# EAGLE design Schematic1 (EAGLE 9.2.2)
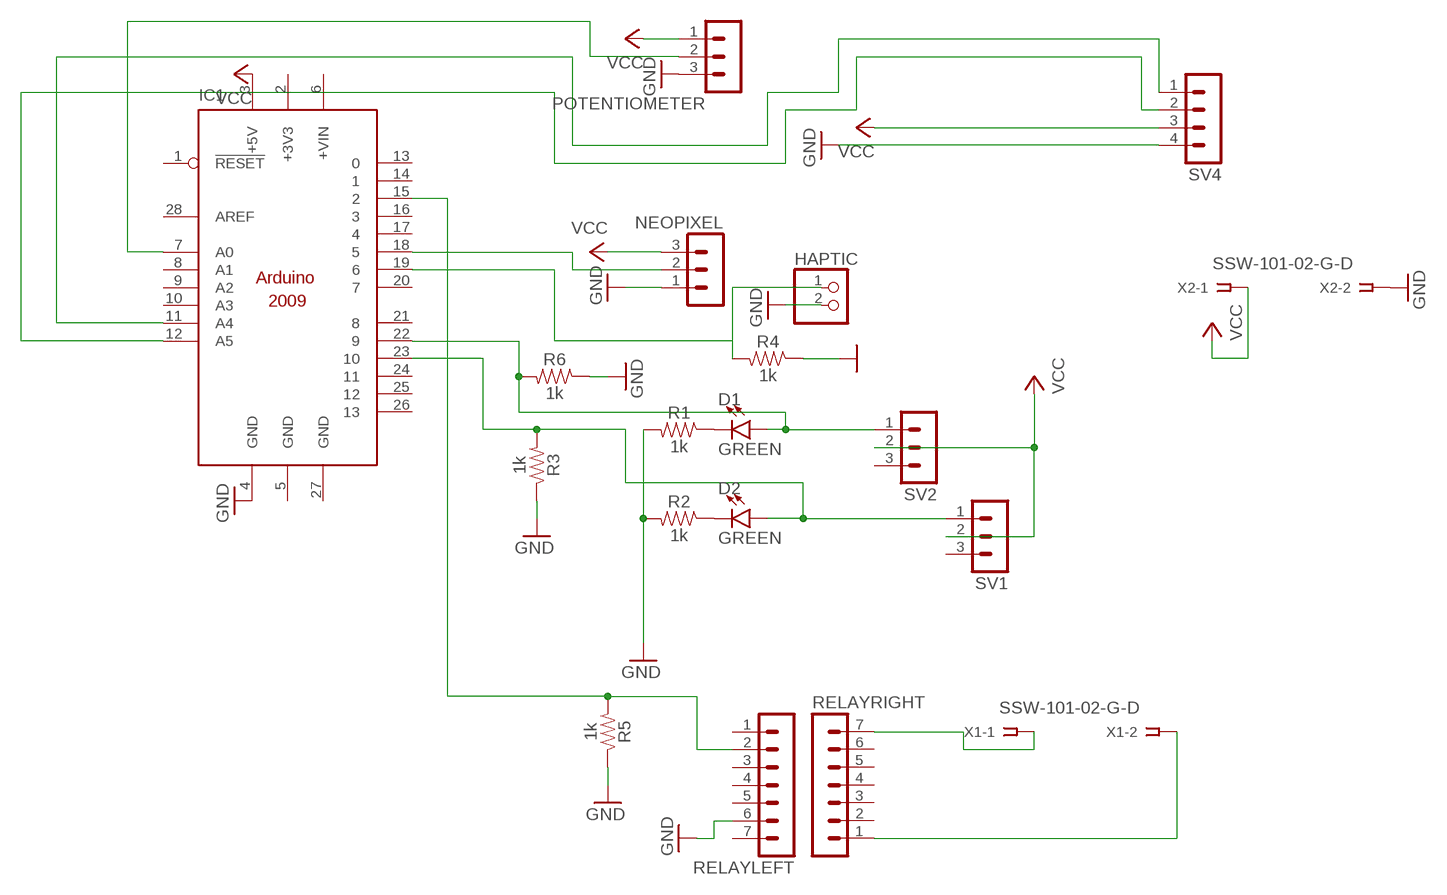
[diagram p0: schematic, sheet 1]

## Parts
D1  GREEN  LED-GREEN1206  [LED-1206]
D2  GREEN  LED-GREEN1206  [LED-1206]
HAPTIC  PINHD-1X2  [1X02]
IC1  ARDUINO2009_10  [ARDUINO2009]
NEOPIXEL  MA03-1  [MA03-1]
POTENTIOMETER  MA03-1  [MA03-1]
R1  1k  1KOHM-0603-1/10W-1%  [0603]
R2  1k  1KOHM-0603-1/10W-1%  [0603]
R3  1k  1KOHM-0603-1/10W-1%  [0603]
R4  1k  1KOHM-0603-1/10W-1%  [0603]
R5  1k  1KOHM-0603-1/10W-1%  [0603]
R6  1k  1KOHM-0603-1/10W-1%  [0603]
RELAYLEFT  MA07-1  [MA07-1]
RELAYRIGHT  MA07-1  [MA07-1]
SV1  MA03-1  [MA03-1]
SV2  MA03-1  [MA03-1]
SV4  MA04-1  [MA04-1]
X1  SSW-101-02-G-D  [SSW-101-02-G-D]
X2  SSW-101-02-G-D  [SSW-101-02-G-D]

## Nets
GND: HAPTIC.2 IC1.4(GND) NEOPIXEL.1 POTENTIOMETER.3 R1.2 R2.2 R3.1 R4.1 R5.1 R6.1 RELAYLEFT.6 SV4.4 X2.2
N$1: D1.C R1.1
N$2: D2.C R2.1
N$4: D2.A IC1.23 R3.2 SV1.1
N$5: D1.A IC1.22 R6.2 SV2.1
N$6: IC1.18 NEOPIXEL.2
N$7: IC1.11(A4) SV4.1
N$8: IC1.12(A5) SV4.2
N$9: HAPTIC.1 IC1.19 R4.2
N$11: RELAYRIGHT.7 X1.1
N$12: IC1.7(A0) POTENTIOMETER.2
N$13: RELAYRIGHT.1 X1.2
N$14: IC1.15 R5.2 RELAYLEFT.2
VCC: IC1.3(+5V) NEOPIXEL.3 POTENTIOMETER.1 SV1.2 SV2.2 SV4.3 X2.1
Unconnected: IC1.1(!RESET) IC1.6(+VIN) IC1.8(A1) IC1.9(A2) IC1.10(A3) IC1.13 IC1.14 IC1.16 IC1.17 IC1.20 IC1.21 IC1.24 IC1.25 IC1.26 IC1.28(AREF) RELAYLEFT.1 RELAYLEFT.3 RELAYLEFT.4 RELAYLEFT.5 RELAYLEFT.7 RELAYRIGHT.2 RELAYRIGHT.3 RELAYRIGHT.4 RELAYRIGHT.5 RELAYRIGHT.6 SV1.3 SV2.3

## Power pins joined to a net without a drawn wire
+3V3: IC1.2(+3V3)
GND: IC1.5(GND) IC1.27(GND)

## Library data of the parts
D1 D2 = SparkFun-LED:LED-GREEN: Green SMD LED Used in manufacturing of various products at SparkFun Packages: 0603 - SMD 0603 package [Product Link] <http://www.futureelectronics.com/en/technologies/semiconductors/optoelectronics/leds/Pages/9894312-LTST-C190GKT.aspx?CrossPart=HSMG-C190&IM=0> LilyPad 1206 - SMD1206 LilyPad package [Product Link] <http://www.futureelectronics.com/en/Technologies/Product.aspx?ProductID=IN150NGHARVATEKCORPORATION2049943&IM=0> 1206 - SMD1206 package [Product Link] <http://www.futureelectronics.com/en/technologies/semiconductors/optoelectronics/leds/Pages/8315665-LTST-C150KGKT.aspx?IM=0> 1206 Bottom Mount -SMD 1206 Bottom Mount [Product Link] <http://www.digikey.com/product-detail/en/lite-on-inc/LTST-C230KGKT/160-1456-1-ND/386854> SparkFun Products: Pro Mini 328 -5V <https://www.sparkfun.com/products/821> RedBoard <https://www.sparkfun.com/products/12757> MP3 Trigger <https://www.sparkfun.com/products/13720> Makey Makey <https://www.sparkfun.com/products/11076>; PROD_ID: DIO-00862
HAPTIC = pinhead:PINHD-1X2: PIN HEADER; SPICEPREFIX: B
IC1 = arduino:ARDUINO2009_1: The Arduino Duemilanove ("2009") is a microcontroller board based on the ATmega168 or ATmega328. - 14 digital input/output pins (of which 6 can be used as PWM outputs) - 6 analog inputs, a 16 MHz crystal oscillator - USB connection - power jack - ISP header - reset button It contains everything needed to support the microcontroller; simply connect it to a computer with a USB cable or power it with a AC-to-DC adapter or battery to get started http://arduino.cc/en/Main/ArduinoBoardDuemilanove
NEOPIXEL POTENTIOMETER SV1 SV2 = con-lstb:MA03-1: PIN HEADER; OC_FARNELL: unknown; OC_NEWARK: unknown
R1-R6 = SparkFun-Resistors:1KOHM: 1kΩ resistor A resistor is a passive two-terminal electrical component that implements electrical resistance as a circuit element. Resistors act to reduce current flow, and, at the same time, act to lower voltage levels within circuits. - Wikipedia; PROD_ID: RES-07856
RELAYLEFT RELAYRIGHT = con-lstb:MA07-1: PIN HEADER; OC_FARNELL: unknown; OC_NEWARK: unknown
SV4 = con-lstb:MA04-1: PIN HEADER; OC_FARNELL: unknown; OC_NEWARK: unknown
X1 X2 = con-samtec:SSW-101-02-G: THROUGH-HOLE .025" SQ POST SOCKET Source: Samtec SSW.pdf; MF: Samtec Inc.; MPN: SSW-101-02-G-D; OC_FARNELL: unknown; OC_NEWARK: 82P1456

## Board
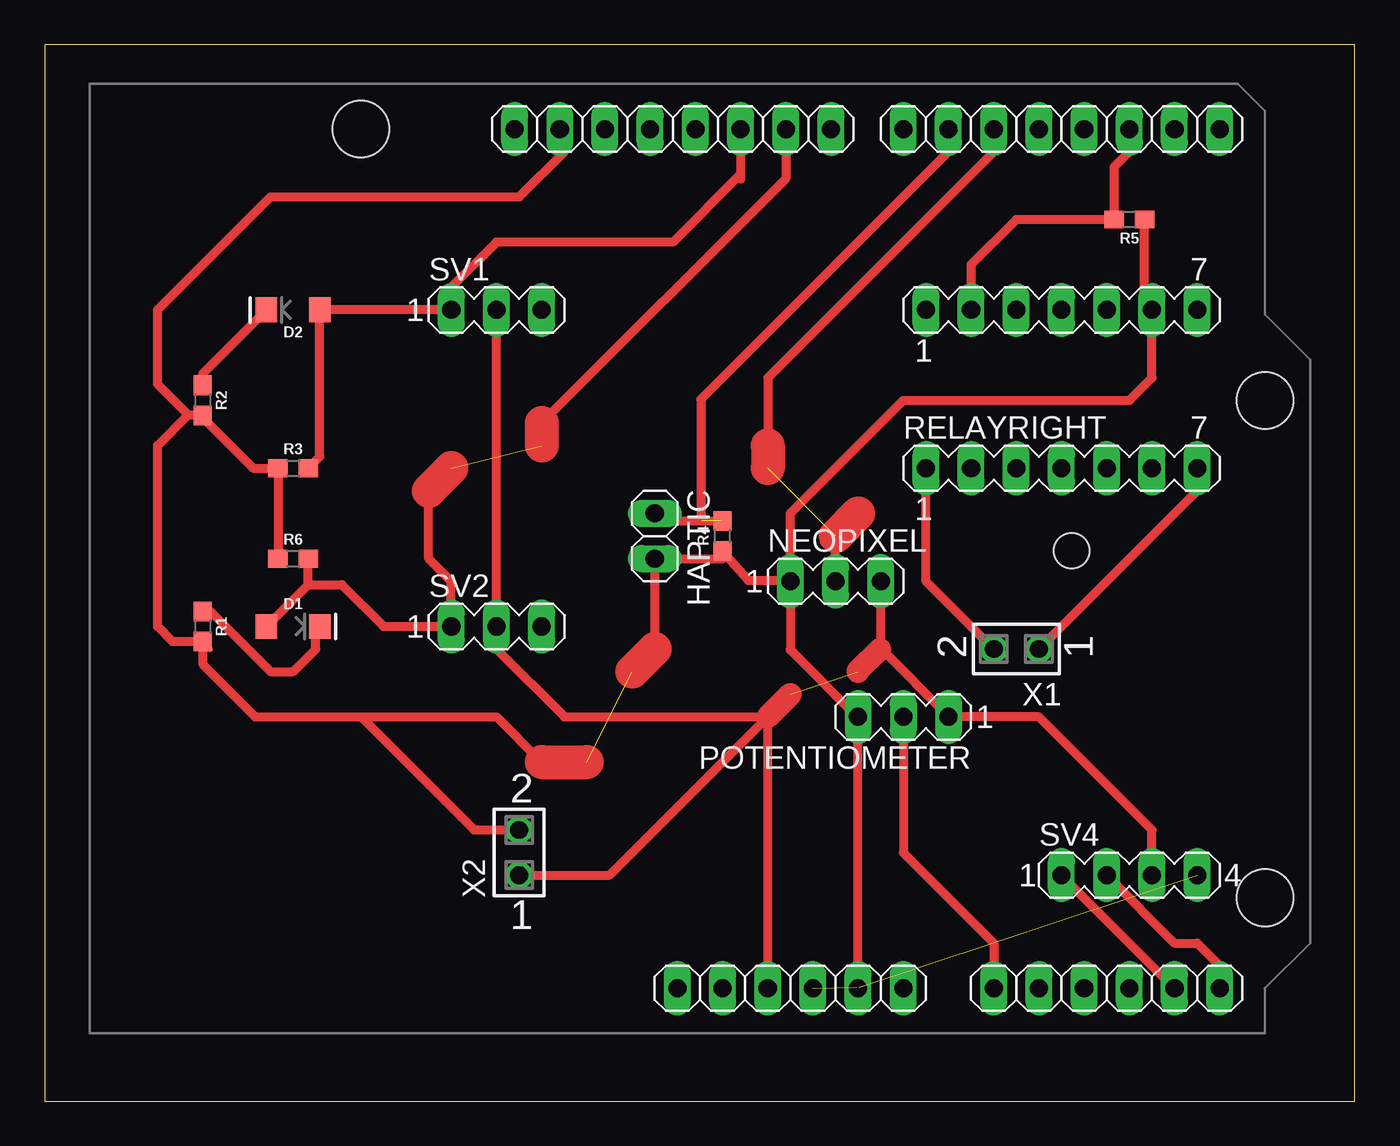
[diagram p1: board, top side]
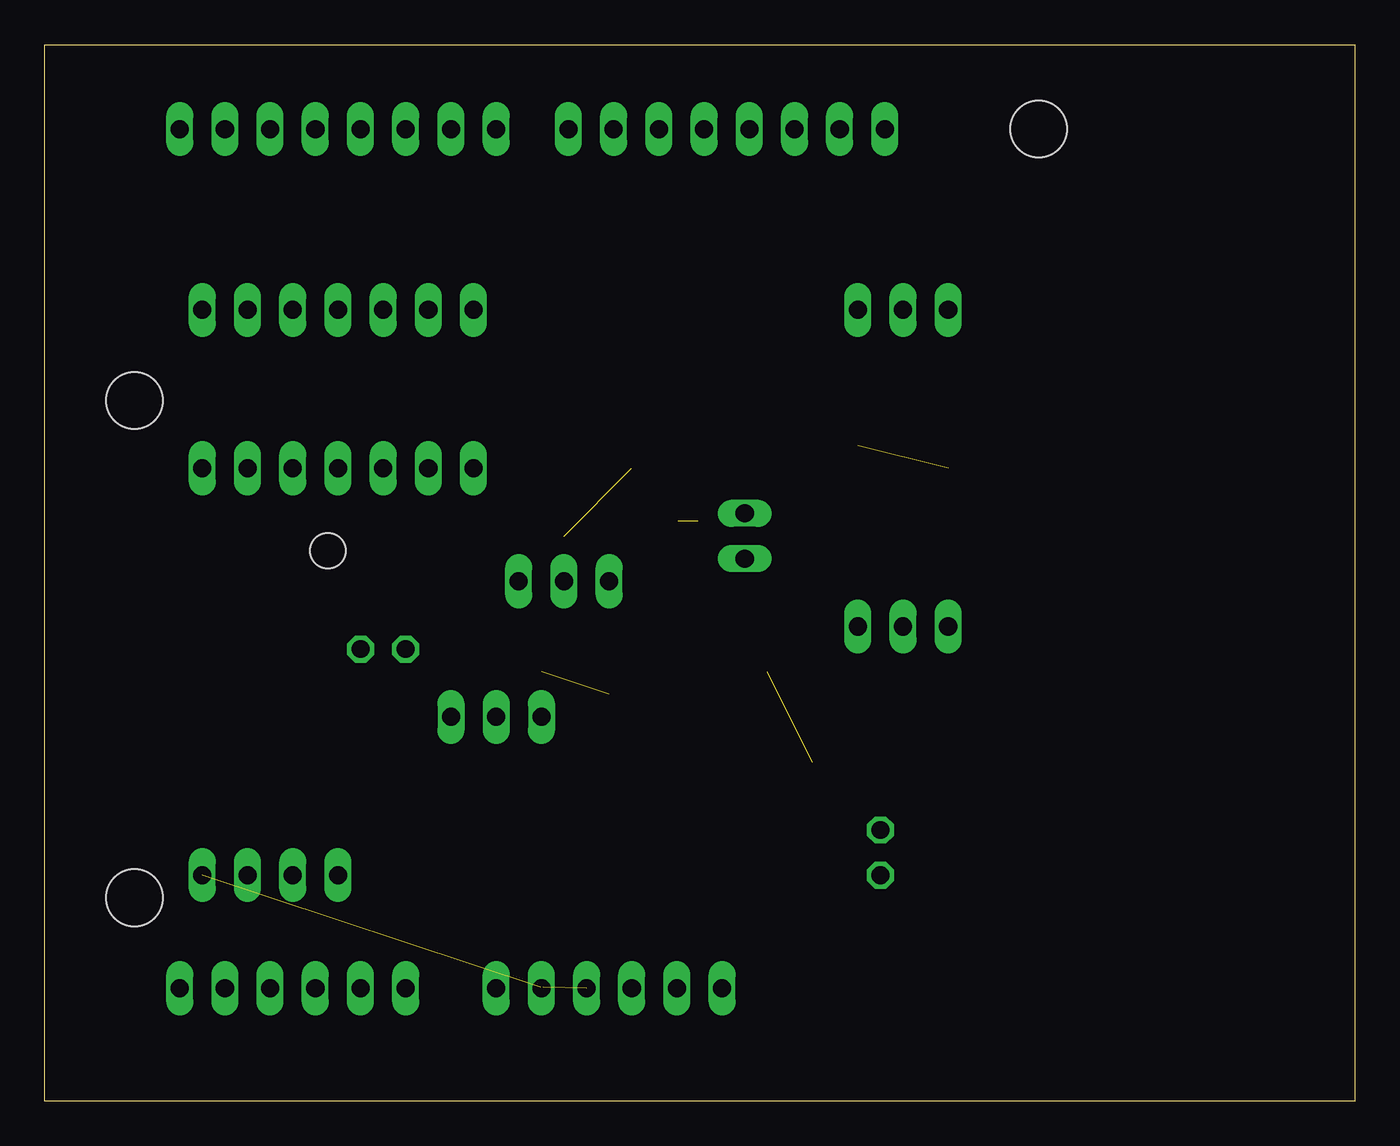
[diagram p2: board, bottom side, seen from below]

Size 73.64 x 59.36 mm. Coordinates in mm from the lower left corner, seen from the top.
Outline: 0,0 73.64,0 73.64,59.36 0,59.36 0,0
Copper layers (1*16): Top 0.035mm / dielectric 1.5mm / Bottom 0.035mm
Design rules "default": minimum track width 6mil, minimum drill 0.35mm, track to track 6mil, track to pad 6mil, pad to pad 6mil, via to via 6mil, smd to smd 6mil, copper to edge 40mil, drill to drill 6mil, minimum pad ring 10mil, minimum via ring 8mil, stop-mask expansion 4mil, vias tented up to drill 0mil, thermal gap 10mil

### Footprints (pad centres in the part's own frame; a part is rotated, then mirrored left to right if it is on the bottom)
LED-1206 = smd 1.2 x 1.4: A -1.5,0; C 1.5,0
1X02 = drill 1.016 long: 1 -1.27,0; 2 1.27,0
ARDUINO2009 = drill 1.016 long: 1 33.02,2.54; 2 35.56,2.54; 3 38.1,2.54; 4 40.64,2.54; 5 43.18,2.54; 6 45.72,2.54; 7 50.8,2.54; 8 53.34,2.54; 9 55.88,2.54; 10 58.42,2.54; 11 60.96,2.54; 12 63.5,2.54; 13 63.5,50.8; 14 60.96,50.8; 15 58.42,50.8; 16 55.88,50.8; 17 53.34,50.8; 18 50.8,50.8; 19 48.26,50.8; 20 45.72,50.8; 21 41.656,50.8; 22 39.116,50.8; 23 36.576,50.8; 24 34.036,50.8; 25 31.496,50.8; 26 28.956,50.8; 27 26.416,50.8; 28 23.876,50.8 | hole 3.2: 15.24,50.8; 66.04,35.56; 66.04,7.62 | hole 2: 55.17,27.114
MA03-1 = drill 1.016 long: 1 -2.54,0; 2 0,0; 3 2.54,0
0603 = smd 1.1 x 1: 1 -0.85,0; 2 0.85,0
MA07-1 = drill 1.016 long: 1 -7.62,0; 2 -5.08,0; 3 -2.54,0; 4 0,0; 5 2.54,0; 6 5.08,0; 7 7.62,0
MA04-1 = drill 1.016 long: 1 -3.81,0; 2 -1.27,0; 3 1.27,0; 4 3.81,0
SSW-101-02-G-D = drill 1 pad 1.5 octagon: 1 0,-1.27; 2 0,1.27

### Placement (x,y rotation side)
D1  13.97,26.67 0 top
D2  13.97,44.45 180 top
HAPTIC  34.29,31.75 270 top
IC1  2.54,3.81 0 top
NEOPIXEL  44.45,29.21 0 top
POTENTIOMETER  48.26,21.59 180 top
R1  8.89,26.67 270 top
R2  8.89,39.37 270 top
R3  13.97,35.56 0 top
R4  38.1,31.75 90 top
R5  60.96,49.53 180 top
R6  13.97,30.48 0 top
RELAYLEFT  57.15,44.45 0 top
RELAYRIGHT  57.15,35.56 0 top
SV1  25.4,44.45 0 top
SV2  25.4,26.67 0 top
SV4  60.96,12.7 0 top
X1  54.61,25.4 90 top
X2  26.67,13.97 0 top

### Tracks (layer width: path | path; a pad name or v marks a point on that pad's centre or on a via)
GND  (3 unrouted)
  Top 0.152: 8.89,25.96 R1.2 9.35,25.35 | 8.89,38.41 R2.2 8.89,38.56 | 43.18,6.4 IC1.4 | 45.62,6.4 IC1.5 45.77,6.4 | 34.39,30.48 HAPTIC.2 | 41.81,29.26 NEOPIXEL.1 | 38.31,30.66 R4.1 | 45.77,21.49 POTENTIOMETER.3 | 61.72,49.53 R5.1
  Top 0.305: R1.2 9.31,25.4
  Top 0.508: 41.81,29.26 39.55,29.26 38.31,30.66 38.12,30.48 HAPTIC.2 34.29,25.4 | 8.08,38.56 6.35,36.83 6.35,26.67 7.2,25.82 R1.2 8.89,24.55 11.85,21.59 17.78,21.59 | 8.08,38.56 6.35,40.28 6.35,44.45 12.7,50.8 26.67,50.8 29.21,53.34 29.21,54.36 IC1.27 | 45.72,21.54 41.91,25.35 NEOPIXEL.1 41.91,33.02 48.26,39.37 60.96,39.37 62.23,40.64 RELAYLEFT.6 61.81,44.87 R5.1 | 45.72,21.54 45.77,21.49 | 8.08,38.56 8.89,38.56 | R6.1 R3.1 11.73,35.56 8.89,38.41 | 17.78,21.59 24.13,15.24 X2.2 | IC1.5 45.72,21.54 | 27.94,19.05 25.4,21.59 17.78,21.59
  Top 1.905: 27.94,19.05 30.48,19.05 | 34.29,25.4 33.02,24.13
  Bottom 0.152: 34.24,30.48 HAPTIC.2 | 45.62,21.64 POTENTIOMETER.3 | 41.96,29.11 NEOPIXEL.1
N$1
  Top 0.508: D1.C 15.24,26.67 15.24,25.4 13.97,24.13 12.7,24.13 10.16,26.67 9.31,27.52 R1.1
N$2
  Top 0.508: D2.C 8.89,40.87 R2.1
N$4
  Top 0.152: 38.76,54.56 39.06,54.56 IC1.23
  Top 0.508: 39.12,53.09 IC1.23 39.12,52.07 | 39.12,52.07 39.12,51.82 | R3.2 15.47,36.21 D2.A SV1.1 22.86,45.72 25.4,48.26 35.31,48.26 39.12,52.07
N$5  (1 unrouted)
  Top 0.508: IC1.22 41.66,51.82 27.94,38.1 | D1.A 14.82,29.02 | 14.82,29.02 R6.2 | 14.82,29.02 16.7,29.02 19.05,26.67 SV2.1 22.86,29.21 21.59,30.48 21.59,34.29
  Top 1.905: 27.94,38.1 27.94,36.83 | 21.59,34.29 22.86,35.56
N$6  (1 unrouted)
  Top 0.508: IC1.18 53.34,53.34 40.64,40.64 40.64,36.83 | NEOPIXEL.2 44.45,31.75
  Top 1.905: 40.64,36.83 40.64,35.56 | 44.45,31.75 45.72,33.02
  Bottom 0.152: 44.55,29.26 NEOPIXEL.2
N$7
  Top 0.508: SV4.1 IC1.11
N$8
  Top 0.508: SV4.2 63.5,8.89 64.77,8.89 66.04,7.62 IC1.12
N$9  (1 unrouted)
  Top 0.152: 38.05,32.61 R4.2 | 36.88,32.61 36.93,32.61
  Top 0.508: 38.05,32.61 34.7,32.61 HAPTIC.1 | IC1.19 50.8,53.34 36.88,39.42 36.88,32.61
N$11
  Top 0.508: RELAYRIGHT.7 64.77,34.29 X1.1
N$12
  Top 0.152: 48.36,21.49 POTENTIOMETER.2 | 53.24,6.4 IC1.7
  Top 0.508: POTENTIOMETER.2 48.26,13.97 53.34,8.89 IC1.7
N$13
  Top 0.508: RELAYRIGHT.1 49.53,29.21 X1.2
N$14
  Top 0.508: IC1.15 60.96,53.34 60.11,52.49 R5.2 54.61,49.53 52.07,46.99 RELAYLEFT.2
VCC  (1 unrouted)
  Top 0.152: 50.8,21.64 POTENTIOMETER.1
  Top 0.508: 46.99,25.45 NEOPIXEL.3 | 50.8,21.64 46.99,25.45 | 46.99,25.45 46.94,25.4 | 40.64,21.59 29.21,21.59 25.4,25.4 SV2.2 SV1.2 | SV4.3 62.23,15.24 55.88,21.59 POTENTIOMETER.1 | X2.1 31.75,12.7 40.64,21.59 | IC1.3 40.64,21.59
  Top 1.27: 46.94,25.4 45.72,24.18 45.72,24.13 | 40.64,21.59 41.91,22.86